# EasyEDA Pro project TC358870 HDMI2MIPI.epro, schematic Schematic3
Board Name: Board3; Create Date: 2024-11-13; Page Name: P1; Project Name: tc358870 HDMI转MIPI; Schematic Name: Schematic3; Update Date: 2024-11-13; Company: 嘉立创EDA; Page Size: A3; Version: V1.0
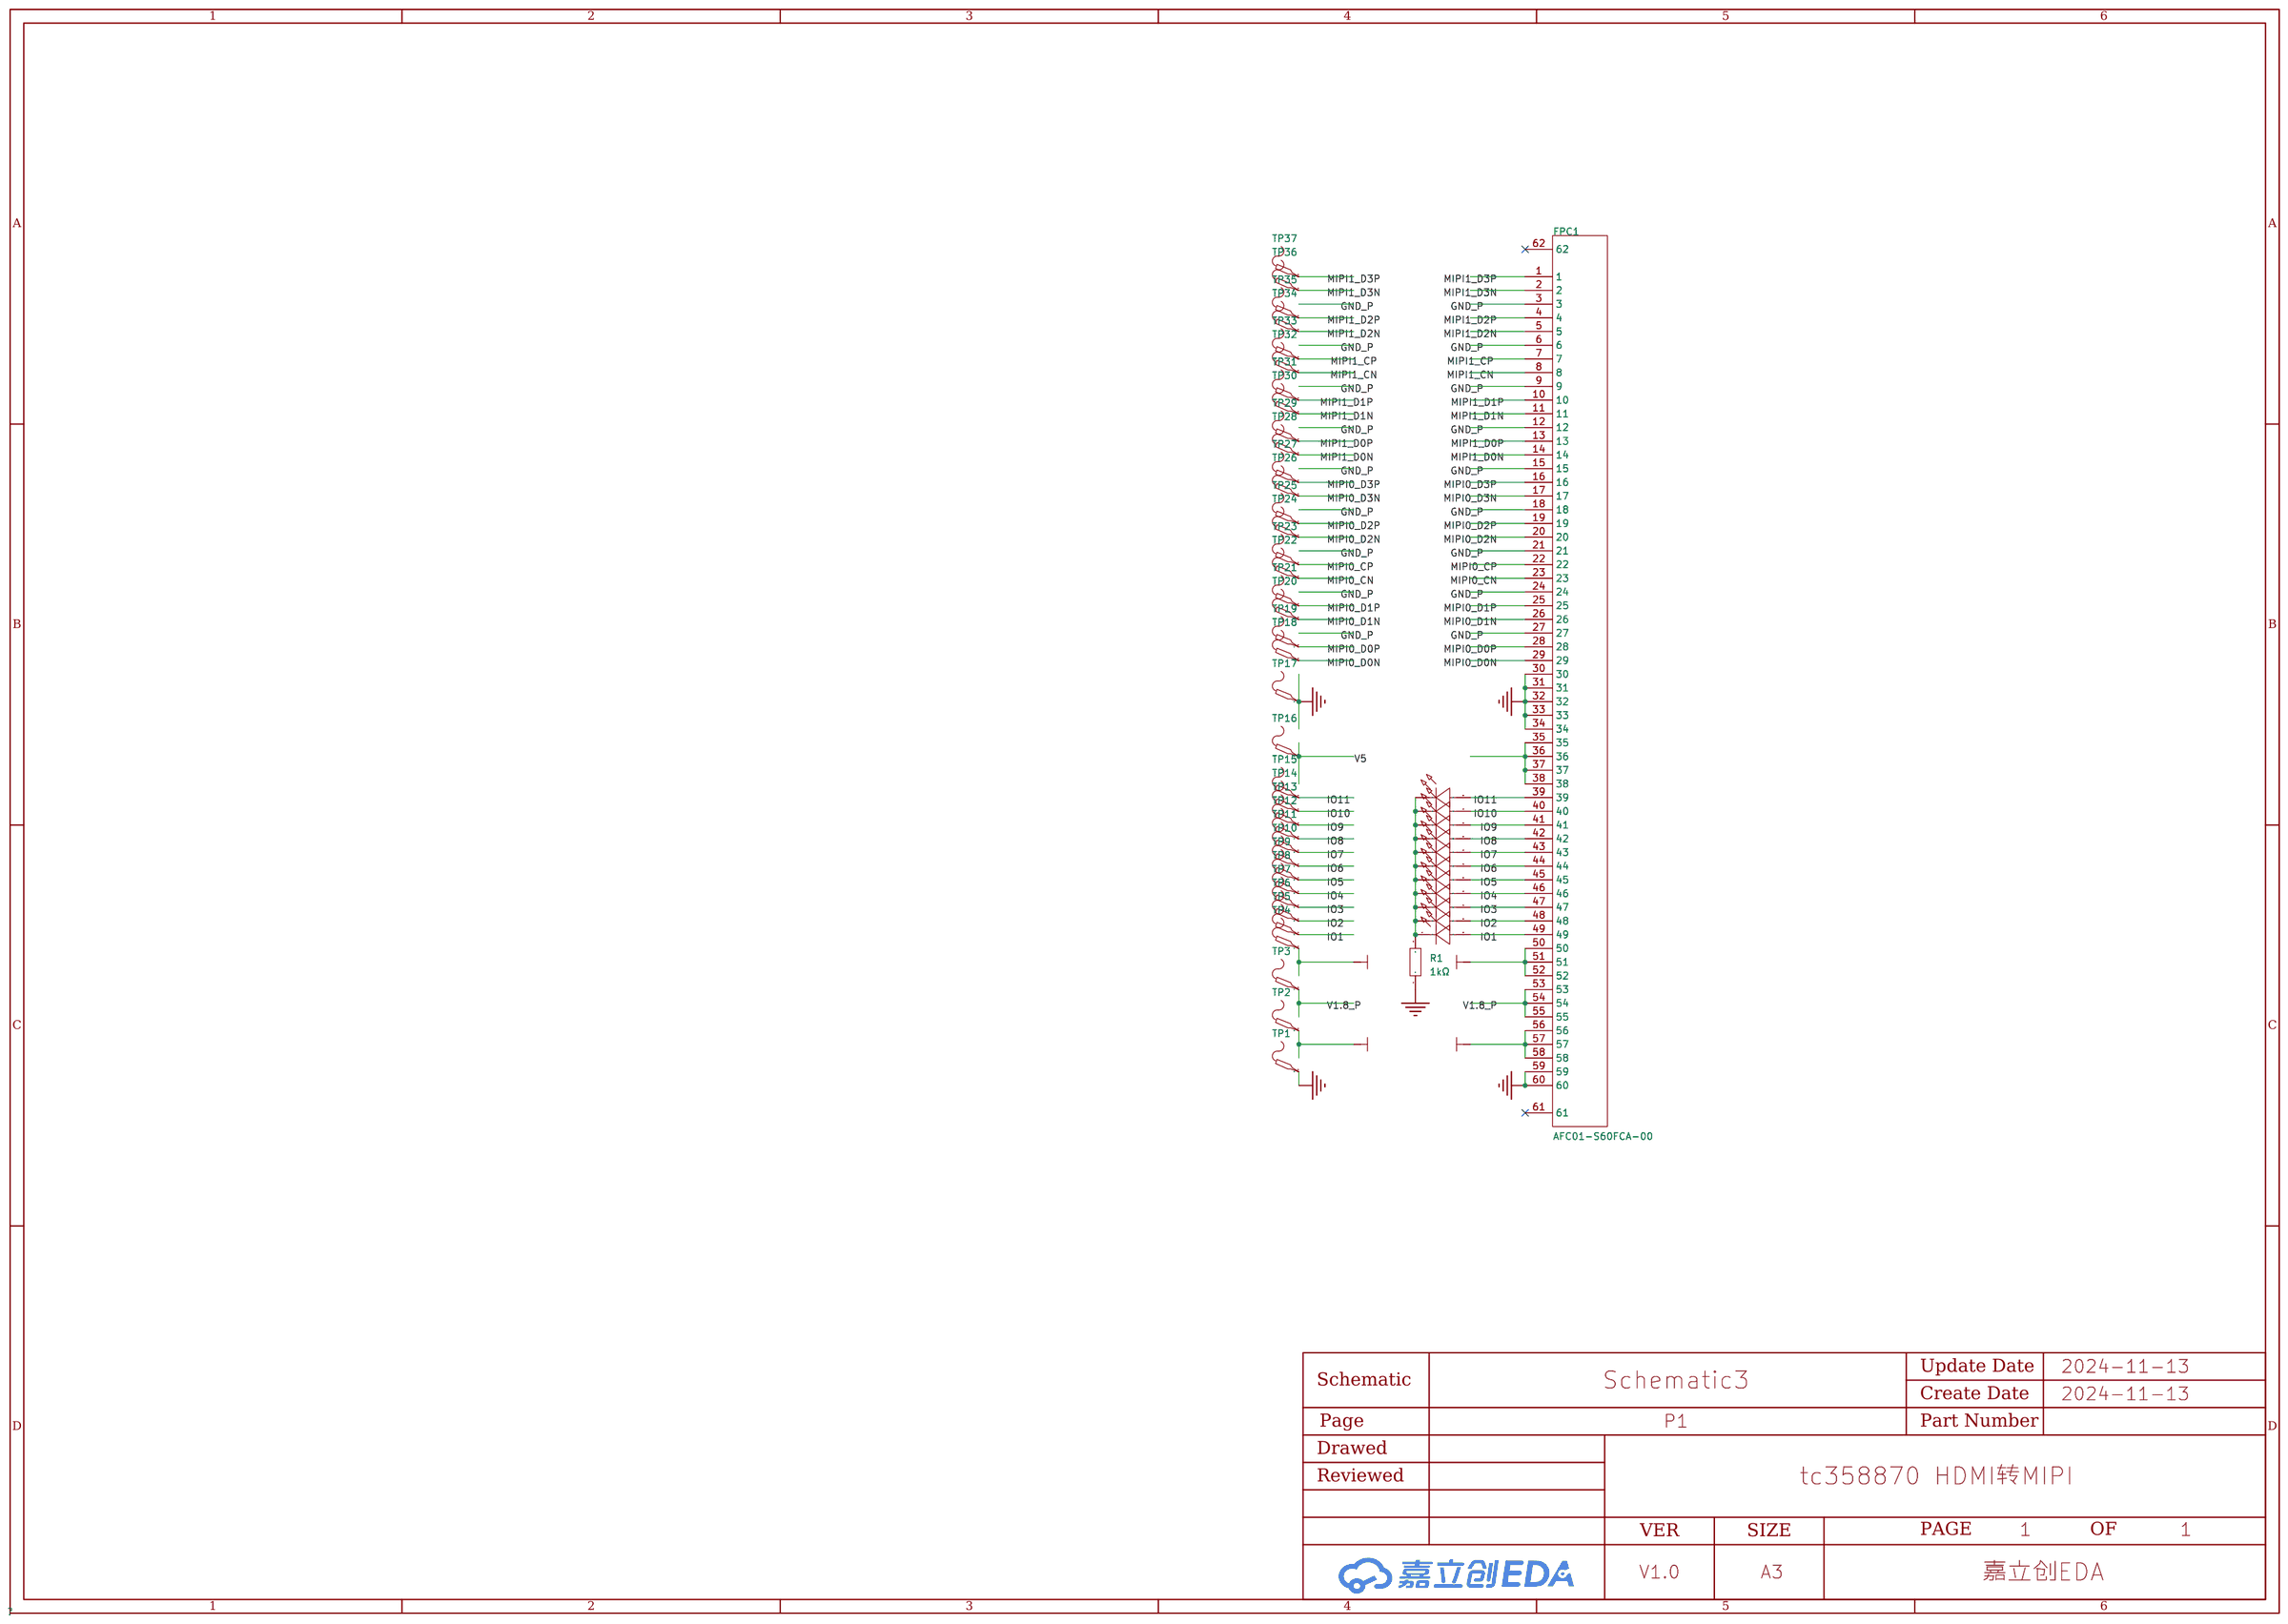
[diagram p0: schematic sheet]

## Parts
FPC1  AFC01-S60FCA-00  [FPC-SMD_AFC01-S60FCC-00]
LED1  XL-1608SURC-06  [LED0603-RD_RED]
LED2  XL-1608SURC-06  [LED0603-RD_RED]
LED3  XL-1608SURC-06  [LED0603-RD_RED]
LED4  XL-1608SURC-06  [LED0603-RD_RED]
LED5  XL-1608SURC-06  [LED0603-RD_RED]
LED6  XL-1608SURC-06  [LED0603-RD_RED]
LED7  XL-1608SURC-06  [LED0603-RD_RED]
LED8  XL-1608SURC-06  [LED0603-RD_RED]
LED9  XL-1608SURC-06  [LED0603-RD_RED]
LED10  XL-1608SURC-06  [LED0603-RD_RED]
LED11  XL-1608SURC-06  [LED0603-RD_RED]
R1  1kΩ  [R0603]
TP1  -  [Test-Point-0.5mm]
TP2  -  [Test-Point-0.5mm]
TP3  -  [Test-Point-0.5mm]
TP4  -  [Test-Point-0.5mm]
TP5  -  [Test-Point-0.5mm]
TP6  -  [Test-Point-0.5mm]
TP7  -  [Test-Point-0.5mm]
TP8  -  [Test-Point-0.5mm]
TP9  -  [Test-Point-0.5mm]
TP10  -  [Test-Point-0.5mm]
TP11  -  [Test-Point-0.5mm]
TP12  -  [Test-Point-0.5mm]
TP13  -  [Test-Point-0.5mm]
TP14  -  [Test-Point-0.5mm]
TP15  -  [Test-Point-0.5mm]
TP16  -  [Test-Point-0.5mm]
TP17  -  [Test-Point-0.5mm]
TP18  -  [Test-Point-0.5mm]
TP19  -  [Test-Point-0.5mm]
TP20  -  [Test-Point-0.5mm]
TP21  -  [Test-Point-0.5mm]
TP22  -  [Test-Point-0.5mm]
TP23  -  [Test-Point-0.5mm]
TP24  -  [Test-Point-0.5mm]
TP25  -  [Test-Point-0.5mm]
TP26  -  [Test-Point-0.5mm]
TP27  -  [Test-Point-0.5mm]
TP28  -  [Test-Point-0.5mm]
TP29  -  [Test-Point-0.5mm]
TP30  -  [Test-Point-0.5mm]
TP31  -  [Test-Point-0.5mm]
TP32  -  [Test-Point-0.5mm]
TP33  -  [Test-Point-0.5mm]
TP34  -  [Test-Point-0.5mm]
TP35  -  [Test-Point-0.5mm]
TP36  -  [Test-Point-0.5mm]
TP37  -  [Test-Point-0.5mm]

## Library data of the parts
FPC1 = AFC01-S60FCA-00: 锁定特性:翻盖式;触点类型:下接;触点数量:60P;间距:0.5mm;安装类型:卧贴;; LCSC Part Name: 间距:0.5mm P数:60P 翻盖式 下接; Supplier Part: C262678; Manufacturer: JS(钜硕电子); Supplier Footprint: SMD,P=0.5mm,卧贴; JLCPCB Part Class: 扩展库; Datasheet: https://atta.szlcsc.com/upload/public/pdf/source/20190726/C11047_78689421E6D6672DE8D11ECCF89B3729.pdf; Supplier: LCSC; Locking Feature: 翻盖式; Contact Type: 下接; Number of Contacts: 60P; Pitch: 0.5mm; Mounting Type: 卧贴; FFC, FCB Thickness: 0.3mm; Height Above Board: 2mm
LED1-LED11 = XL-1608SURC-06: 发光颜色:红色;功率:55mW;正向电流:25mA;主波长:617nm~621nm;透镜颜色:无色透明透镜;色温:-;发光角度:120°;载带方式:正贴;工作温度:-30℃~+85℃;; Supplier Part: C965799; Manufacturer: XINGLIGHT(成兴光); Supplier Footprint: 0603; JLCPCB Part Class: 扩展库; Datasheet: https://atta.szlcsc.com/upload/public/pdf/source/20221102/D860AFDD1CDB02C5A8064103A32707E2.pdf; Supplier: LCSC; Emitted Color: 红色; Power Dissipation: 55mW; Forward Current: 25mA; Dominant Wavelength: 617nm~621nm; Peak Wavelength: 623nm; Lens Color: 无色透明透镜; Viewing Angle: 120°; Mounting Sytle: 正贴; Operating Temperature: -30℃~+85℃
R1 = 0603WAF1001T5E: 电阻类型:厚膜电阻;阻值:1kΩ;精度:±1%;功率:100mW;温度系数:±100ppm/℃;最大工作电压:75V;工作温度范围:-55℃~+155℃;; LCSC Part Name: 1kΩ ±1% 100mW; Supplier Part: C21190; Manufacturer: UNI-ROYAL(厚声); Supplier Footprint: 0603; JLCPCB Part Class: 基础库; Datasheet: https://atta.szlcsc.com/upload/public/pdf/source/20200306/C422600_1E6D84923E4A46A82E41ADD87F860B5C.pdf; Supplier: LCSC; Type: 厚膜电阻; Tolerance: ±1%; Power(Watts): 100mW; Temperature Coefficient: ±100ppm/℃; Overload Voltage (Max): 75V; Operating Temperature Range: -55℃~+155℃
TP1-TP37 = Test-Point: Test Point 测试点

## Nets
GND: FPC1.30 FPC1.31 FPC1.32 FPC1.33 FPC1.34 FPC1.59 FPC1.60 R1.1 TP1.1 TP17.1
GND_P: FPC1.3 FPC1.6 FPC1.9 FPC1.12 FPC1.15 FPC1.18 FPC1.21 FPC1.24 FPC1.27
V1.1: FPC1.56 FPC1.57 FPC1.58 TP2.1
V1.8_P: FPC1.53 FPC1.54 FPC1.55 TP3.1
V3.3: FPC1.50 FPC1.51 FPC1.52 TP4.1
V5: FPC1.35 FPC1.36 FPC1.37 FPC1.38 TP16.1
IO1: FPC1.49 LED1.2(A) TP5.1
IO2: FPC1.48 LED2.2(A) TP6.1
IO3: FPC1.47 LED3.2(A) TP7.1
IO4: FPC1.46 LED4.2(A) TP8.1
IO5: FPC1.45 LED5.2(A) TP9.1
IO6: FPC1.44 LED6.2(A) TP10.1
IO7: FPC1.43 LED7.2(A) TP11.1
IO8: FPC1.42 LED8.2(A) TP12.1
IO9: FPC1.41 LED9.2(A) TP13.1
IO10: FPC1.40 LED10.2(A) TP14.1
IO11: FPC1.39 LED11.2(A) TP15.1
MIPI0_CN: FPC1.23 TP22.1
MIPI0_CP: FPC1.22 TP23.1
MIPI0_D0N: FPC1.29 TP18.1
MIPI0_D0P: FPC1.28 TP19.1
MIPI0_D1N: FPC1.26 TP20.1
MIPI0_D1P: FPC1.25 TP21.1
MIPI0_D2N: FPC1.20 TP24.1
MIPI0_D2P: FPC1.19 TP25.1
MIPI0_D3N: FPC1.17 TP26.1
MIPI0_D3P: FPC1.16 TP27.1
MIPI1_CN: FPC1.8 TP32.1
MIPI1_CP: FPC1.7 TP33.1
MIPI1_D0N: FPC1.14 TP28.1
MIPI1_D0P: FPC1.13 TP29.1
MIPI1_D1N: FPC1.11 TP30.1
MIPI1_D1P: FPC1.10 TP31.1
MIPI1_D2N: FPC1.5 TP34.1
MIPI1_D2P: FPC1.4 TP35.1
MIPI1_D3N: FPC1.2 TP36.1
MIPI1_D3P: FPC1.1 TP37.1
Net-(LED1-1): LED1.1(K) LED2.1(K) LED3.1(K) LED4.1(K) LED5.1(K) LED6.1(K) LED7.1(K) LED8.1(K) LED9.1(K) LED10.1(K) LED11.1(K) R1.2

Not connected (* = marked no-connect by the designer): FPC1 61* 62*
